# EAGLE design pinky 2.3 (EAGLE 6.4)
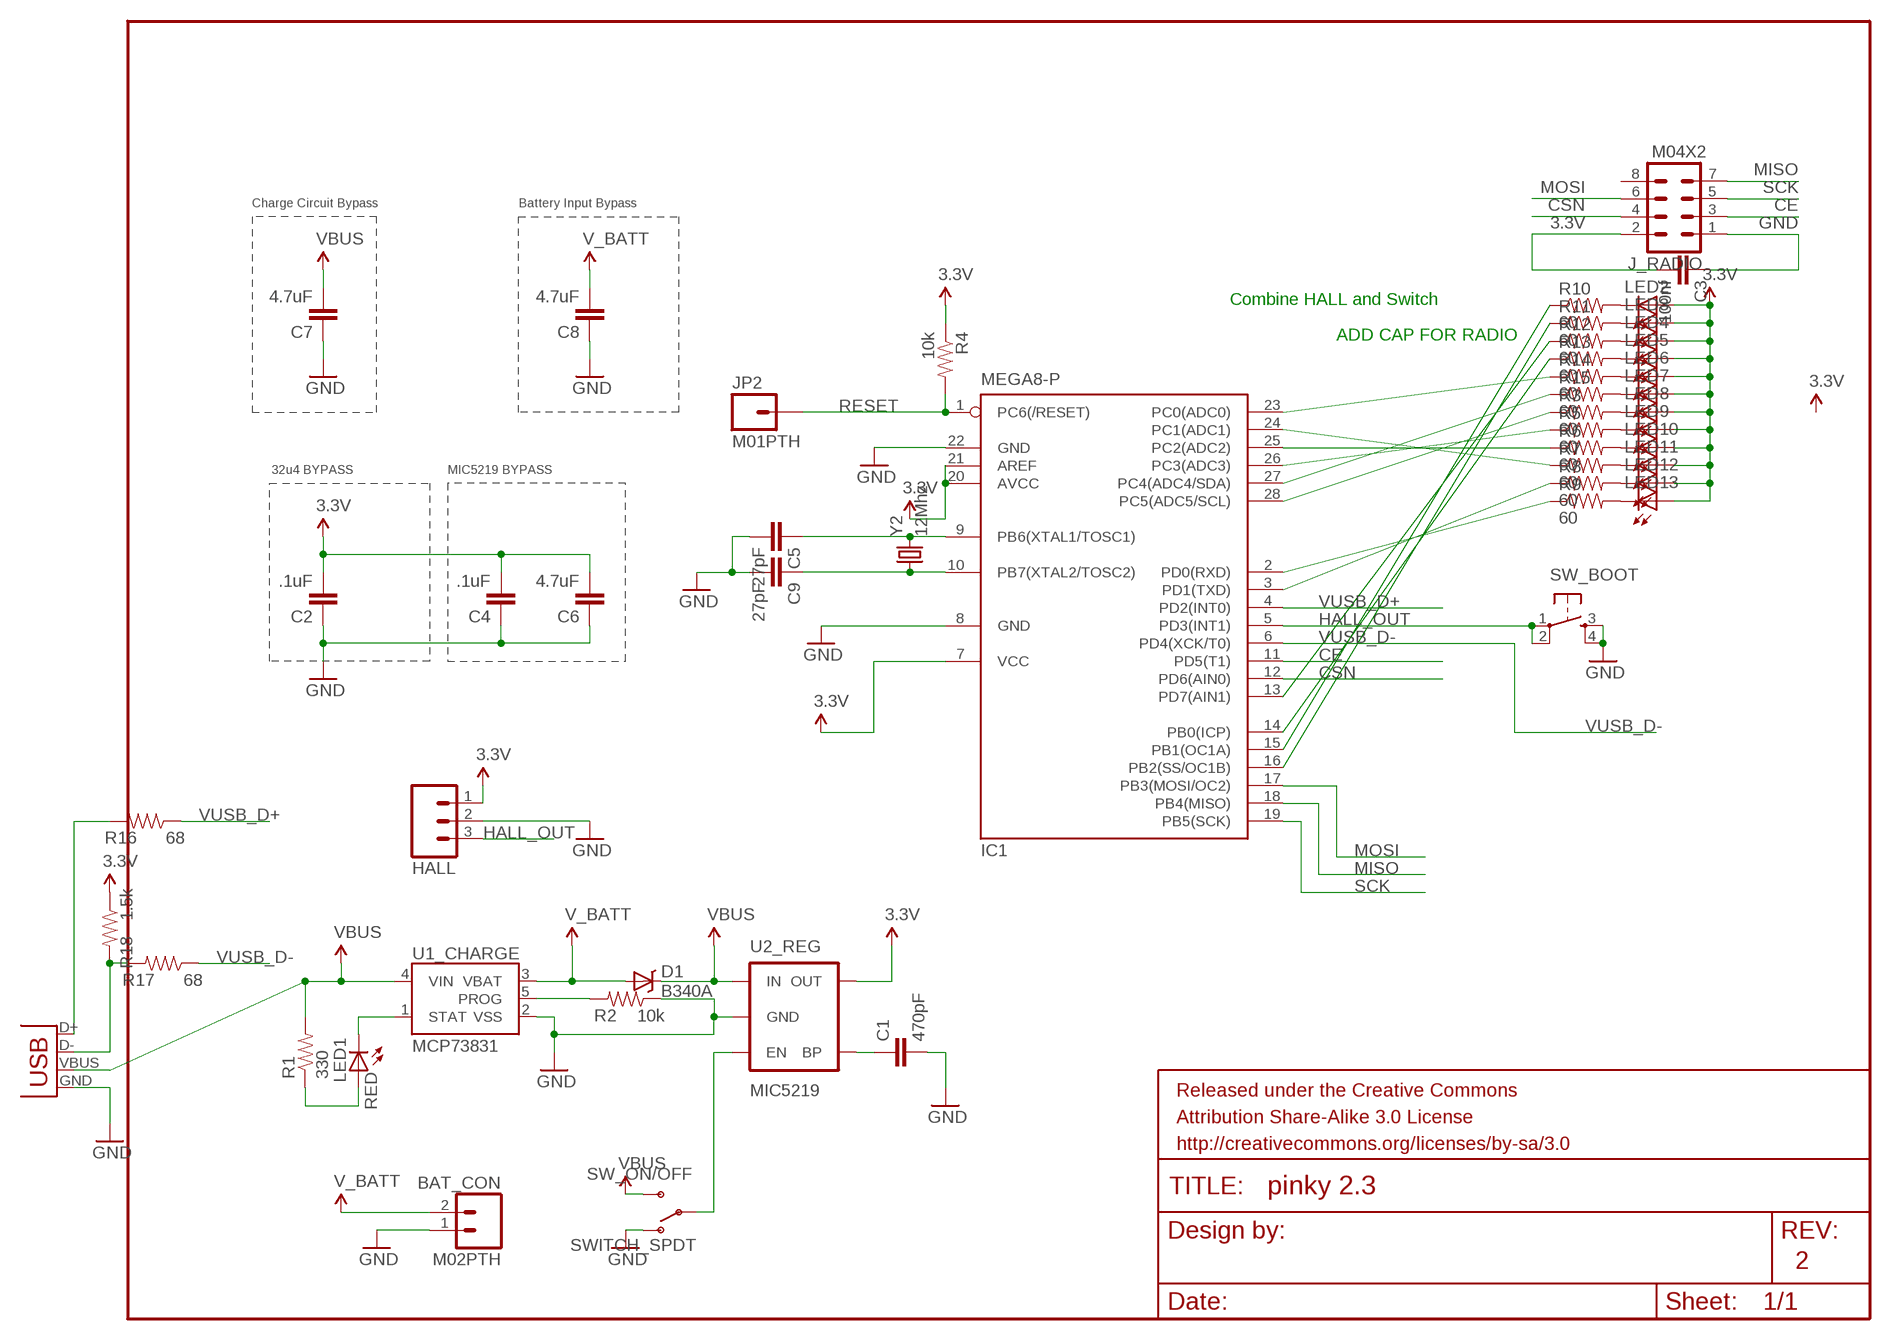
[diagram p0: schematic, sheet 1]

## Parts
BAT_CON  M02PTH  [1X02]
C1  470pF  CAP1206  [1206]
C2  .1uF  CAP1206  [1206]
C3  100nf  CAP1206  [1206]
C4  .1uF  CAP1206  [1206]
C5  27pF  CAP1206  [1206]
C6  4.7uF  CAP1206  [1206]
C7  4.7uF  CAP1206  [1206]
C8  4.7uF  CAP1206  [1206]
C9  27pF  CAP1206  [1206]
D1  B340A  DIODE-SCHOTTKY_  [SMA-DIODE]
HALL  M03PTH  [1X03]
IC1  MEGA8-P  [DIL28-3]
J_RADIO  M04X2  [2X4]
JP1  USB-MB-H  [USB-MB-H]
JP2  M01PTH  [1X01]
LED1  RED  LED1206  [LED-1206]
LED2  LED1206  [LED-1206]
LED3  LED1206  [LED-1206]
LED4  LED1206  [LED-1206]
LED5  LED1206  [LED-1206]
LED6  LED1206  [LED-1206]
LED7  LED1206  [LED-1206]
LED8  LED1206  [LED-1206]
LED9  LED1206  [LED-1206]
LED10  LED1206  [LED-1206]
LED11  LED1206  [LED-1206]
LED12  LED1206  [LED-1206]
LED13  LED1206  [LED-1206]
R1  330  RESISTOR1206  [1206]
R2  10k  RESISTOR1206  [1206]
R3  60  RESISTOR1206  [1206]
R4  10k  RESISTOR1206  [1206]
R5  60  RESISTOR1206  [1206]
R6  60  RESISTOR1206  [1206]
R7  60  RESISTOR1206  [1206]
R8  60  RESISTOR1206  [1206]
R9  60  RESISTOR1206  [1206]
R10  60  RESISTOR1206  [1206]
R11  60  RESISTOR1206  [1206]
R12  60  RESISTOR1206  [1206]
R13  60  RESISTOR1206  [1206]
R14  60  RESISTOR1206  [1206]
R15  60  RESISTOR1206  [1206]
R16  68  RESISTOR1206  [1206]
R17  68  RESISTOR1206  [1206]
R18  1.5k  RESISTOR1206  [1206]
SW_BOOT  TAC_SWITCHPTH  [TACTILE-PTH]
SW_ON/OFF  SWITCH_SPDT  [KPS-1290]
U1_CHARGE  MCP73831  [SOT23-5]
U2_REG  MIC5219  V_REG_MIC5219SMD  [SOT23-5]
Y2  12Mhz  CRYSTALHC49US  [HC49US]

## Nets
3.3V: C2.2 C3.2 C4.2 C6.2 HALL.1 IC1.7(VCC) IC1.20(AVCC) IC1.21(AREF) J_RADIO.2 LED2.A LED3.A LED4.A LED5.A LED6.A LED7.A LED8.A LED9.A LED10.A LED11.A LED12.A LED13.A R4.1 R18.1 U2_REG.5(OUT)
5V: C7.2 D1.C JP1.VBUS R1.2 SW_ON/OFF.S U1_CHARGE.4(VIN) U2_REG.1(IN) ; supply symbol labelled VBUS
CE: IC1.11(PD5(T1)) J_RADIO.3
CSN: IC1.12(PD6(AIN0)) J_RADIO.4
D+: JP1.D+ R16.2
D-: JP1.D- R17.2 R18.2
GND: BAT_CON.1 C1.2 C2.1 C3.1 C4.1 C5.2 C6.1 C7.1 C8.1 C9.2 HALL.2 IC1.8(GND) IC1.22(GND) J_RADIO.1 JP1.GND R2.1 SW_BOOT.3 SW_BOOT.4 SW_ON/OFF.O U1_CHARGE.2(VSS) U2_REG.2(GND)
HALL_OUT: HALL.3 IC1.5(PD3(INT1)) SW_BOOT.1 SW_BOOT.2
MISO: IC1.18(PB4(MISO)) J_RADIO.7
MOSI: IC1.17(PB3(MOSI/OC2)) J_RADIO.6
N$2: SW_ON/OFF.P U2_REG.3(EN)
N$3: LED1.A R1.1
N$4: LED1.C U1_CHARGE.1(STAT)
N$5: LED8.C R3.2
N$6: R2.2 U1_CHARGE.5(PROG)
N$7: LED9.C R5.2
N$8: C1.1 U2_REG.4(BP)
N$9: LED10.C R6.2
N$10: IC1.13(PD7(AIN1)) R12.1
N$11: LED11.C R7.2
N$12: LED12.C R8.2
N$13: LED13.C R9.2
N$14: LED2.C R10.2
N$15: LED3.C R11.2
N$16: LED4.C R12.2
N$17: LED5.C R13.2
N$18: LED6.C R14.2
N$19: LED7.C R15.2
N$20: IC1.15(PB1(OC1A)) R10.1
N$21: IC1.16(PB2(SS/OC1B)) R11.1
N$22: IC1.14(PB0(ICP)) R13.1
N$23: IC1.2(PD0(RXD)) R9.1
N$25: IC1.3(PD1(TXD)) R8.1
N$26: IC1.23(PC0(ADC0)) R14.1
N$27: IC1.27(PC4(ADC4/SDA)) R15.1
N$28: IC1.28(PC5(ADC5/SCL)) R3.1
N$29: IC1.24(PC1(ADC1)) R7.1
N$30: IC1.25(PC2(ADC2)) R6.1
N$31: IC1.26(PC3(ADC3)) R5.1
N$34: C5.1 IC1.9(PB6(XTAL1/TOSC1)) Y2.2
N$35: C9.1 IC1.10(PB7(XTAL2/TOSC2)) Y2.1
RESET: IC1.1(PC6(/RESET)) JP2.1 R4.2
SCK: IC1.19(PB5(SCK)) J_RADIO.5
V_BATT: BAT_CON.2 C8.2 D1.A U1_CHARGE.3(VBAT)
VUSB_D+: IC1.4(PD2(INT0)) R16.1
VUSB_D-: IC1.6(PD4(XCK/T0)) R17.1
Unconnected: J_RADIO.8

## Notes on the sheet
- Charge Circuit Bypass | Battery Input Bypass
- Combine HALL and Switch
- ADD CAP FOR RADIO
- 32u4 BYPASS | MIC5219 BYPASS
- 2

## Library data of the parts
BAT_CON = SparkFun-Connectors:M02: Standard 2-pin 0.1" header. Use with - straight break away headers ( PRT-00116) - right angle break away headers (PRT-00553) - swiss pins (PRT-00743) - machine pins (PRT-00117) - female headers (PRT-00115) Molex polarized connector foot print use with: PRT-08233 with associated crimp pins and housings. 2.54_SCREWTERM for use with PRT-10571. 3.5mm Screw Terminal footprints for PRT-08084 5mm Screw Terminal footprints for use with PRT-08433
C1 = SparkFun-Passives:CAP: Capacitor Standard 0603 ceramic capacitor, and 0.1" leaded capacitor.; PROD_ID: CAP-07884
C2 C4 = SparkFun-Passives:CAP: Capacitor Standard 0603 ceramic capacitor, and 0.1" leaded capacitor.; PROD_ID: CAP-00810
C3 C5 C7-C9 = SparkFun-Passives:CAP: Capacitor Standard 0603 ceramic capacitor, and 0.1" leaded capacitor.; PROD_ID: CAP-10300
C6 = SparkFun-Passives:CAP: Capacitor Standard 0603 ceramic capacitor, and 0.1" leaded capacitor.; PROD_ID: CAP-08280
D1 = SparkFun-DiscreteSemi:DIODE-SCHOTTKY: Commonly MBRA140.; PROD_ID: DIO-09886
HALL = SparkFun-Connectors:M03: Header 3 Standard 3-pin 0.1" header. Use with straight break away headers (SKU : PRT-00116), right angle break away headers (PRT-00553), swiss pins (PRT-00743), machine pins (PRT-00117), and female headers (PRT-00115). Molex polarized connector foot print use with SKU : PRT-08232 with associated crimp pins and housings.
IC1 = atmel:MEGA8-P: MICROCONTROLLER 8 Kbytes FLASH, 1 kbytes SRAM, 512 bytes EEPROM, USART, 4-channel 10 bit ADC, 2-channel 8 bit ADC Pin compatible with Atmega48, ATMega88, ATMega168 Source: avr.lbr; OC_FARNELL: unknown; OC_NEWARK: unknown
J_RADIO = SparkFun-Connectors:M04X2: .1" header, two rows of four.
JP1 = SparkFun-Connectors:USB: USB Connectors USB-B-PTH is fully proven SKU : PRT-00139/CONN-08278 USB-miniB is fully proven SKU : PRT-00587 USB-A-PCB is untested. USB-A-H is throughly reviewed, but untested. Spark Fun Electronics SKU : PRT-00437 USB-B-SMT is throughly reviewed, but untested. Needs silkscreen touching up. USB-A-S has not been used/tested USB-MB-H has not been used/tested USB-MICROB has been used. CONN-09505
JP2 = SparkFun-Connectors:M01: Header 1 Standard 1-pin 0.1" header. Use with straight break away headers (SKU : PRT-00116), right angle break away headers (PRT-00553), swiss pins (PRT-00743), machine pins (PRT-00117), and female headers (PRT-00115).
LED1 = SparkFun-LED:LED: LEDs Standard schematic elements and footprints for 5mm, 3mm, 1206, and 0603 sized LEDs. 5mm - Spark Fun Electronics SKU : COM-00529 (and others); PROD_ID: DIO-00819
LED2-LED13 = SparkFun-LED:LED: LEDs Standard schematic elements and footprints for 5mm, 3mm, 1206, and 0603 sized LEDs. 5mm - Spark Fun Electronics SKU : COM-00529 (and others)
R1 = SparkFun-Passives:RESISTOR: Resistor Basic schematic elements and footprints for 0603, 1206, and PTH resistors.; PROD_ID: RES-00818
R2-R18 = SparkFun-Passives:RESISTOR: Resistor Basic schematic elements and footprints for 0603, 1206, and PTH resistors.; PROD_ID: RES-00824
SW_BOOT = SparkFun-Electromechanical:TAC_SWITCH: Momentary Switch Button commonly used for reset or general input. Spark Fun Electronics SKU : COM-00097 SMT- SWCH-08247
SW_ON/OFF = SparkFun-Electromechanical:SWITCH_SPDT: Side-actuated SPDT slide switch, as used on the Arduino Pro
U1_CHARGE = SparkFun-PowerIC:MCP73831: Miniature single cell, fully integrated Li-Ion, Li-polymer charge management controller http://ww1.microchip.com/downloads/en/DeviceDoc/21984a.pdf; PROD_ID: IC-09995
U2_REG = SparkFun-PowerIC:V_REG_MIC5219: V_REG MIC5219 Standard 500mA LDO voltage regulator in SOT-23 layout. Micrel part MIC5219. BP (by-pass) pin is used to lower output noise with 470pF cap, may be left open.; PROD_ID: VREG-09872
Y2 = SparkFun-FreqCtrl:CRYSTAL: Various standard crystals. Proven footprints. Spark Fun Electronics SKU : COM-00534

## Board
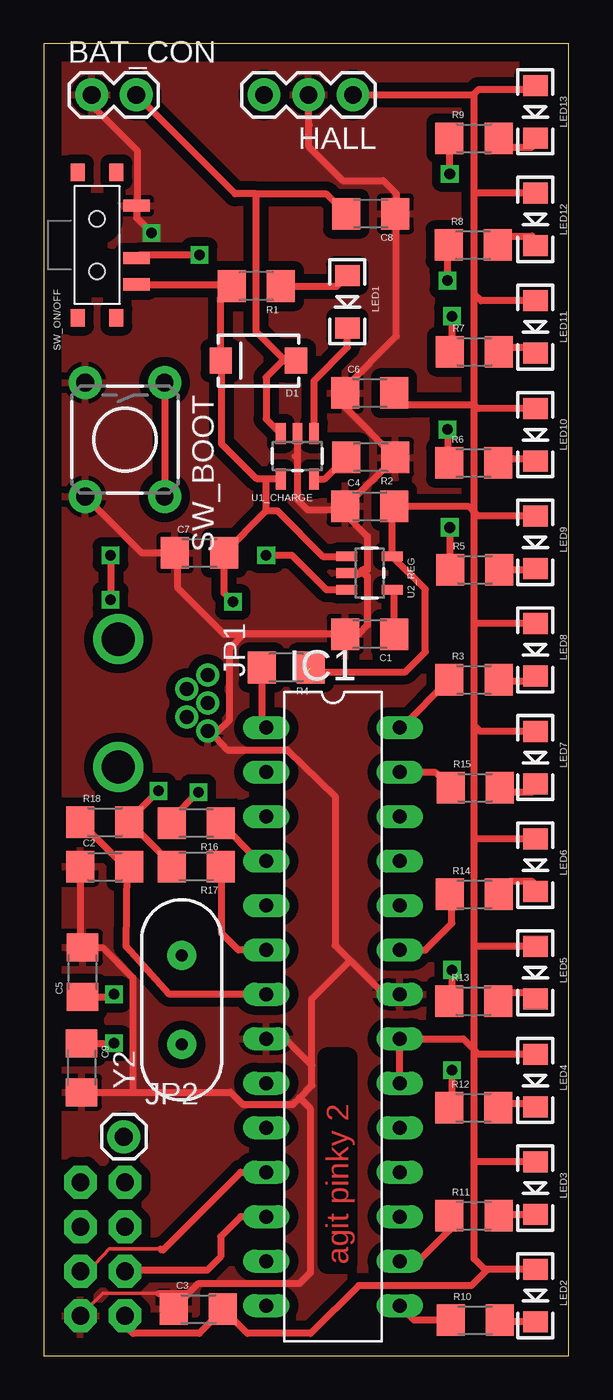
[diagram p1: board, top side]
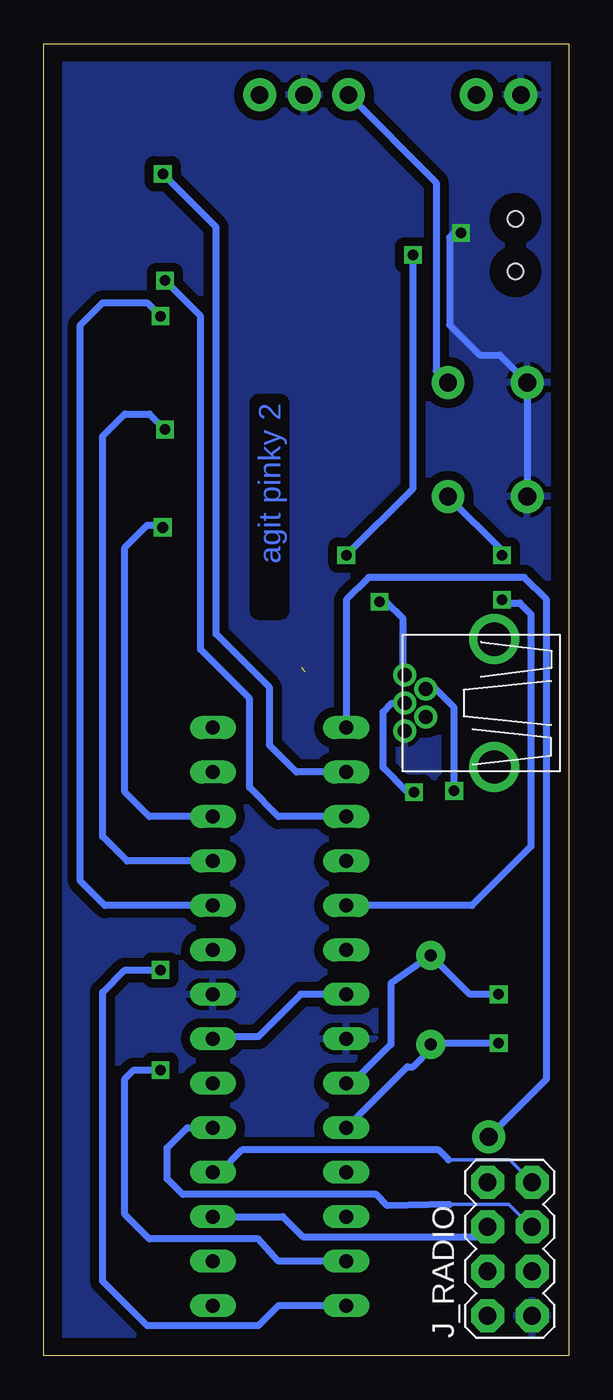
[diagram p2: board, bottom side, seen from below]

Size 29.97 x 74.93 mm. Coordinates in mm from the lower left corner, seen from the top.
Outline: 0,0 29.97,0 29.97,74.93 0,74.93 0,0
Copper layers (1*16): Top 0.035mm / dielectric 1.5mm / Bottom 0.035mm
Design rules "default *": minimum track width 16mil, minimum drill 24mil, track to track 8mil, track to pad 8mil, pad to pad 8mil, via to via 8mil, smd to smd 8mil, copper to edge 40mil, drill to drill 8mil, minimum pad ring 10mil, minimum via ring 8mil, stop-mask expansion 4mil, vias tented up to drill 0mil, thermal gap 10mil

### Footprints (pad centres in the part's own frame; a part is rotated, then mirrored left to right if it is on the bottom)
1X02 = drill 1.016 pad 1.88: 1 0,0; 2 2.54,0
1206 = smd 1.6 x 1.8: 1 -1.4,0; 2 1.4,0
SMA-DIODE = smd 1.27 x 1.47: A -2.15,0; C 2.15,0
1X03 = drill 1.016 pad 1.88: 1 0,0; 2 2.54,0; 3 5.08,0
DIL28-3 = drill 0.813 long: 1 -16.51,-3.81; 2 -13.97,-3.81; 3 -11.43,-3.81; 4 -8.89,-3.81; 5 -6.35,-3.81; 6 -3.81,-3.81; 7 -1.27,-3.81; 8 1.27,-3.81; 9 3.81,-3.81; 10 6.35,-3.81; 11 8.89,-3.81; 12 11.43,-3.81; 13 13.97,-3.81; 14 16.51,-3.81; 15 16.51,3.81; 16 13.97,3.81; 17 11.43,3.81; 18 8.89,3.81; 19 6.35,3.81; 20 3.81,3.81; 21 1.27,3.81; 22 -1.27,3.81; 23 -3.81,3.81; 24 -6.35,3.81; 25 -8.89,3.81; 26 -11.43,3.81; 27 -13.97,3.81; 28 -16.51,3.81
2X4 = drill 1.016 pad 1.88 octagon: 1 -3.81,-1.27; 2 -3.81,1.27; 3 -1.27,-1.27; 4 -1.27,1.27; 5 1.27,-1.27; 6 1.27,1.27; 7 3.81,-1.27; 8 3.81,1.27
USB-MB-H = drill 0.8: D+ 5.1,0; D- 3.9,0.8; GND 5.1,-1.6; ID 3.9,-0.8; VBUS 5.1,1.6 | drill 1.9: P$6 0,-3.65; P$7 0,3.65
1X01 = drill 1.016 pad 1.88: 1 0,0
LED-1206 = smd 1.2 x 1.4: A -1.5,0; C 1.5,0
TACTILE-PTH = drill 1.016 pad 1.88: 1 -3.251,2.261; 2 3.251,2.261; 3 -3.251,-2.261; 4 3.251,-2.261
KPS-1290 = smd 0.7 x 1.5: O -2.25,2.25; P 0.75,2.25; S 2.25,2.25 | smd 1 x 0.8: P$1 -4.15,1.1; P$2 -4.15,-1.1; P$3 4.15,-1.1; P$4 4.15,1.1 | hole 0.9: -1.5,0; 1.5,0
SOT23-5 = smd 0.55 x 1.2: 1 -0.95,-1.3; 2 0,-1.3; 3 0.95,-1.3; 4 0.95,1.3; 5 -0.95,1.3
HC49US = drill 0.7 pad 1.651: 1 -2.54,0; 2 2.54,0

### Placement (x,y rotation side)
BAT_CON  2.73,72.01 0 top
C1  18.61,41.21 180 top
C2  3.49,27.94 0 top
C3  8.83,2.67 0 top
C4  18.61,48.51 0 top
C5  2.22,21.91 90 top
C6  18.61,54.99 0 top
C7  8.89,45.85 0 top
C8  18.67,65.21 180 top
C9  2.16,16.45 270 top
D1  12.26,56.83 180 top
HALL  17.65,72.01 180 top
IC1  16.51,19.37 270 top
J_RADIO  3.37,6.1 90 bottom
JP1  4.25,37.27 0 top
JP2  4.57,12.51 0 top
LED1  17.34,60.2 270 top
LED2  28.07,3.43 270 top
LED3  28.07,9.58 270 top
LED4  28.07,15.72 270 top
LED5  28.07,21.87 270 top
LED6  28.07,28.02 270 top
LED7  28.07,34.16 270 top
LED8  28.07,40.31 270 top
LED9  28.07,46.46 270 top
LED10  28.07,52.6 270 top
LED11  28.07,58.75 270 top
LED12  28.07,64.9 270 top
LED13  28.07,71.04 270 top
R1  12.13,61.09 180 top
R2  18.67,51.31 180 top
R3  24.56,38.61 0 top
R4  13.84,39.31 180 top
R5  24.61,44.89 0 top
R6  24.54,50.99 0 top
R7  24.59,57.34 0 top
R8  24.51,63.44 0 top
R9  24.56,69.53 0 top
R10  24.64,2.03 0 top
R11  24.56,8 0 top
R12  24.54,14.16 0 top
R13  24.54,20.26 0 top
R14  24.59,26.35 0 top
R15  24.64,32.45 0 top
R16  8.7,30.42 180 top
R17  8.7,27.94 180 top
R18  3.49,30.48 0 top
SW_BOOT  4.64,52.32 270 top
SW_ON/OFF  3.05,63.44 270 top
U1_CHARGE  14.48,51.37 180 top
U2_REG  18.61,44.7 270 top
Y2  7.87,20.32 90 top

### Tracks (layer width: path | path; a pad name or v marks a point on that pad's centre or on a via)
3.3V  (1 unrouted)
  Top 0.406: LED2.A 25.34,4.93 | 25.34,4.93 25.17,4.93 24.57,5.52 24.57,11.11 | 24.57,11.11 24.57,17.46 | 24.57,17.46 24.57,23.3 | 24.57,23.3 24.57,29.65 | 24.57,29.65 24.57,36.01 | 24.57,36.01 24.57,41.85 | 24.57,41.85 24.57,48.2 | 24.57,48.2 24.57,54.29 | 24.57,54.29 24.57,60.64 | 24.57,60.64 24.57,66.48 | 24.57,66.48 24.57,72.07 | 24.57,72.07 24.83,72.33 27.85,72.33 LED13.A | LED3.A 24.61,11.08 24.57,11.11 | LED4.A 24.81,17.22 24.57,17.46 | LED5.A 24.64,23.37 24.57,23.3 | LED6.A 24.71,29.52 24.57,29.65 | LED7.A 24.92,35.66 24.57,36.01 | LED8.A 24.61,41.81 24.57,41.85 | LED9.A 24.81,47.96 24.57,48.2 | LED10.A 24.76,54.1 24.57,54.29 | LED11.A 24.97,60.25 24.57,60.64 | LED12.A 24.66,66.4 24.57,66.48 | 24.57,17.46 23.94,18.1 IC1.21 IC1.20 | 24.57,48.2 24.26,48.51 C4.2 19.91,48.41 U2_REG.5 21.78,43.78 21.78,40.2 20.64,39.05 15.05,39.05 | HALL.1 24.51,72.01 24.57,72.07 | 24.57,54.29 20.7,54.29 C6.2 | 25.34,4.93 24.41,4 17.97,4 15.24,1.27 11.62,1.27 C3.2 10.23,2.61 8.89,1.27 5.08,1.27 4.64,1.71 J_RADIO.2 | IC1.7 7.18,20.64 4.7,23.37 4.76,27.81 C2.2 4.63,27.94 R18.1
  Bottom 0.406: IC1.7 15.3,20.64 17.72,18.22 20.19,18.22 IC1.21
5V  (via drill 0.6)
  Top 0.406: U1_CHARGE.4 12.7,50.07 | 10.38,60.74 10.11,60.46 D1.C 10.16,56.78 10.16,52.07 12.16,50.07 12.7,50.07 | 10.38,60.74 R1.2 | 12.7,48.26 12.7,50.07 | SW_ON/OFF.S 9.93,61.19 10.38,60.74 | 12.7,48.26 C7.2 10.29,43.56 v10.79,43.05 | 12.7,48.26 13.34,48.26 15.94,45.66 U2_REG.1
  Bottom 0.406: JP1.VBUS 9.46,38.98 9.46,42.1 10.41,43.05 v10.79,43.05
CE
  Top 0.203: J_RADIO.3 2.54,4.83 3.75,6.1 6.67,6.1
  Top 0.406: 6.67,6.1 6.79,6.03 11.24,10.48 IC1.11
CSN
  Top 0.406: IC1.12 11.24,7.94 10.1,6.79 10.1,5.65 9.34,4.89 4.7,4.89 J_RADIO.4
D+  (via drill 0.6)
  Top 0.406: R16.2 7.3,30.67 v8.83,32.19
  Bottom 0.406: v8.83,32.19 9.21,32.19 10.6,33.59 10.6,36.77 10.1,37.27 JP1.D+
D-  (via drill 0.6)
  Top 0.406: R17.2 7.3,28.07 R18.2 4.89,30.61 v6.54,32.26
  Bottom 0.406: v6.54,32.26 6.54,37.02 7.62,38.1 8.13,38.1 JP1.D-
GND  (via drill 0.6)
  Top 0.203: J_RADIO.1 3.37,3.56 6.54,3.56
  Top 0.406: HALL.2 15.11,70.29 | 15.11,70.29 15.11,69.09 17.08,67.12 19.37,67.12 20.13,66.36 20.13,65.28 C8.1 20.13,65.15 20.13,58.23 17.14,55.24 17.14,55.05 C6.1 17.21,54.17 R2.1 17.27,48.51 C4.1 17.02,48.32 | U1_CHARGE.2 14.48,51.24 | 14.48,51.24 14.48,48.9 15.05,48.32 17.02,48.32 | 17.02,48.32 17.02,48.26 18.48,46.8 18.48,44.9 18.22,44.9 17.97,44.64 17.37,44.64 U2_REG.2 18.29,44.7 18.48,44.51 18.48,41.72 17.97,41.21 C1.2 11.43,41.21 | 14.35,51.37 14.48,51.24 | BAT_CON.1 2.48,71.56 2.6,71.56 5.33,68.83 5.33,65.72 SW_ON/OFF.O 5.3,65 v6.16,64.14 | 15.18,70.29 15.11,70.29 | SW_BOOT.4 5.6,45.85 C7.1 7.62,45.72 7.62,43.88 10.29,41.21 11.43,41.21 | 11.43,41.21 10.6,40.39 10.6,36.32 9.96,35.67 JP1.GND 9.47,35.67 10.48,34.61 13.91,34.61 16.64,31.94 16.64,23.43 17.49,22.57 | C9.2 5.08,15.05 | 5.08,15.05 10.67,15.05 11.37,14.35 14.22,14.35 14.61,14.73 | 14.61,14.73 15.3,15.43 15.3,16.57 | 15.3,16.57 13.91,17.97 12.83,17.97 IC1.8 | IC1.22 19.43,20.64 17.49,22.57 | C2.1 2.09,23.44 C5.2 3.36,23.31 5.08,21.59 5.08,15.05 | 6.54,3.56 8.26,3.56 | 8.26,3.56 8.83,4.13 14.61,4.13 15.24,4.76 15.24,14.1 14.61,14.73 | 8.26,3.56 8.26,3.5 C3.1 | 15.3,16.57 15.3,20.38 17.49,22.57
  Bottom 0.406: SW_BOOT.4 SW_BOOT.3 3.95,57.15 5.08,57.15 6.79,58.86 6.79,63.88 6.54,64.14 v6.16,64.14
  pour Bottom (isolate 0.508): 0,74.93 29.21,74.93 29.21,0 0,0
  pour Top (isolate 0.508): 0,74.93 29.21,74.93 29.21,0 0,0
HALL_OUT  (via drill 0.6)
  Top 0.406: SW_BOOT.1 SW_BOOT.2 | v3.81,45.72 v3.81,43.18
  Bottom 0.406: HALL.3 7.57,67 7.57,56.25 SW_BOOT.1 | SW_BOOT.2 3.81,45.99 v3.81,45.72 | v3.81,43.18 3.62,42.99 2.79,42.99 2.16,42.35 2.16,29.08 5.52,25.72 IC1.5
MISO
  Bottom 0.203: J_RADIO.7 3.37,11.18 6.86,11.18
  Bottom 0.406: 6.86,11.18 7.43,11.75 18.67,11.75 19.94,10.48 IC1.18
MOSI
  Bottom 0.406: IC1.17 16.32,7.94 15.18,6.79 5.21,6.79 J_RADIO.6
N$2  (via drill 0.6)
  Top 0.406: v8.89,62.87 5.48,62.87 SW_ON/OFF.P | v12.7,45.72 14.16,45.72 16.13,43.75 U2_REG.3
  Bottom 0.406: v12.7,45.72 8.89,49.53 v8.89,62.87
N$3
  Top 0.406: R1.1 16.72,61.09 LED1.A
N$4
  Top 0.406: U1_CHARGE.1 15.43,55.69 17.34,57.59 LED1.C
N$5
  Top 0.406: LED8.C 27.88,38.54 26.61,38.54 R3.2
N$6
  Top 0.406: U1_CHARGE.5 16.03,50.07 R2.2
N$7
  Top 0.406: R5.2 27.88,44.9 LED9.C
N$8
  Top 0.406: C1.1 20.01,43.65 U2_REG.4
N$9
  Top 0.406: LED10.C 27.88,51.24 26.61,51.24 R6.2
N$10  (via drill 0.6)
  Top 0.406: v23.3,16.32 23.3,14.33 R12.1
  Bottom 0.406: IC1.13 16.57,5.4 17.72,6.67 23.94,6.67 25.34,8.06 25.34,15.81 24.83,16.32 v23.3,16.32
N$11
  Top 0.406: LED11.C 27.88,57.59 26.61,57.59 R7.2
N$12
  Top 0.406: LED12.C 27.88,63.94 26.61,63.94 R8.2
N$13
  Top 0.406: LED13.C 27.88,69.03 26.61,69.03 R9.2
N$14
  Top 0.406: LED2.C 26.14,1.93 R10.2
N$15
  Top 0.406: LED3.C 27.88,8.06 26.61,8.06 R11.2
N$16
  Top 0.406: LED4.C 27.88,14.41 26.61,14.41 R12.2
N$17
  Top 0.406: LED5.C 27.88,20.77 26.61,20.77 R13.2
N$18
  Top 0.406: LED6.C 27.88,27.11 26.61,27.11 R14.2
N$19
  Top 0.406: LED7.C 27.88,32.19 26.61,32.19 R15.2
N$20
  Top 0.406: R10.1 21.14,2.03 IC1.15
N$21
  Top 0.406: R11.1 23.16,7.16 21.53,5.52 20.45,5.52 IC1.16
N$22  (via drill 0.6)
  Top 0.406: v23.3,22.04 23.3,20.43 R13.1
  Bottom 0.406: IC1.14 16.57,2.86 17.72,1.71 24.07,1.71 26.61,4.25 26.61,20.77 25.34,22.04 v23.3,22.04
N$23  (via drill 0.6)
  Top 0.406: v23.18,67.5 23.18,69.52 R9.1
  Bottom 0.406: IC1.2 15.56,33.34 17.08,34.86 17.08,38.16 20.13,41.21 20.13,64.45 v23.18,67.5
N$25  (via drill 0.6)
  Top 0.406: v23.05,61.4 23.05,63.38 R8.1
  Bottom 0.406: IC1.3 16.57,30.8 18.22,32.45 18.22,37.53 21.02,40.32 21.02,59.37 v23.05,61.4
N$26
  Top 0.406: IC1.23 21.78,23.18 23.3,24.7 23.3,26.23 R14.1
N$27
  Top 0.406: IC1.27 22.35,33.34 R15.1
N$28
  Top 0.406: IC1.28 20.43,35.88 R3.1
N$29  (via drill 0.6)
  Top 0.406: v23.3,59.37 23.3,57.46 R7.1
  Bottom 0.406: IC1.24 26.48,25.72 27.88,27.11 27.88,58.86 26.61,60.13 24.07,60.13 v23.3,59.37
N$30  (via drill 0.6)
  Top 0.406: v23.05,52.9 23.05,51.08 R6.1
  Bottom 0.406: IC1.25 25.21,28.26 26.61,29.65 26.61,52.51 25.34,53.78 23.94,53.78 v23.05,52.9
N$31  (via drill 0.64)
  Top 0.406: v23.18,47.31 23.18,44.93 R5.1
  Bottom 0.406: IC1.26 23.94,30.8 25.34,32.19 25.34,46.16 24.07,47.43 23.3,47.43 v23.18,47.31
N$34  (via drill 0.6)
  Top 0.406: C5.1 3.87,20.51 v4,20.64
  Bottom 0.406: IC1.9 12.38,15.56 10.16,17.78 10.16,21.27 Y2.2 5.65,20.64 v4,20.64
N$35  (via drill 0.6)
  Top 0.406: C9.1 v4,17.85 v4,17.84
  Bottom 0.406: IC1.10 9.21,16.51 8.89,16.51 7.87,17.53 Y2.1 7.81,17.84 v4,17.84
RESET
  Top 0.406: R4.2 12.44,36.13 IC1.1
  Bottom 0.406: JP2.1 1.27,15.81 1.27,43.18 2.54,44.45 11.43,44.45 12.7,43.18 IC1.1
SCK
  Bottom 0.203: J_RADIO.5 2.16,7.37 3.43,8.64 6.79,8.64
  Bottom 0.406: 6.79,8.64 10.35,8.57 10.99,9.21 22.04,9.21 22.92,10.1 22.92,11.87 21.78,13.02 IC1.19
V_BATT
  Top 0.406: D1.A 13.78,56.83 | 13.78,56.83 12.13,58.48 12.13,66.36 | 12.13,66.36 10.92,66.36 BAT_CON.2 | 12.13,66.36 16.13,66.36 C8.2 | 13.78,56.83 13.65,56.83 12.7,55.88 12.7,53.5 U1_CHARGE.3
VUSB_D+
  Top 0.406: IC1.4 12.26,28.26 R16.1
VUSB_D-
  Top 0.406: IC1.6 11.11,23.18 10.16,24.13 10.16,27.88 R17.1

### Text on the board
Top: agit pinky 2
Bottom: agit pinky 2
tOrigins: + | -